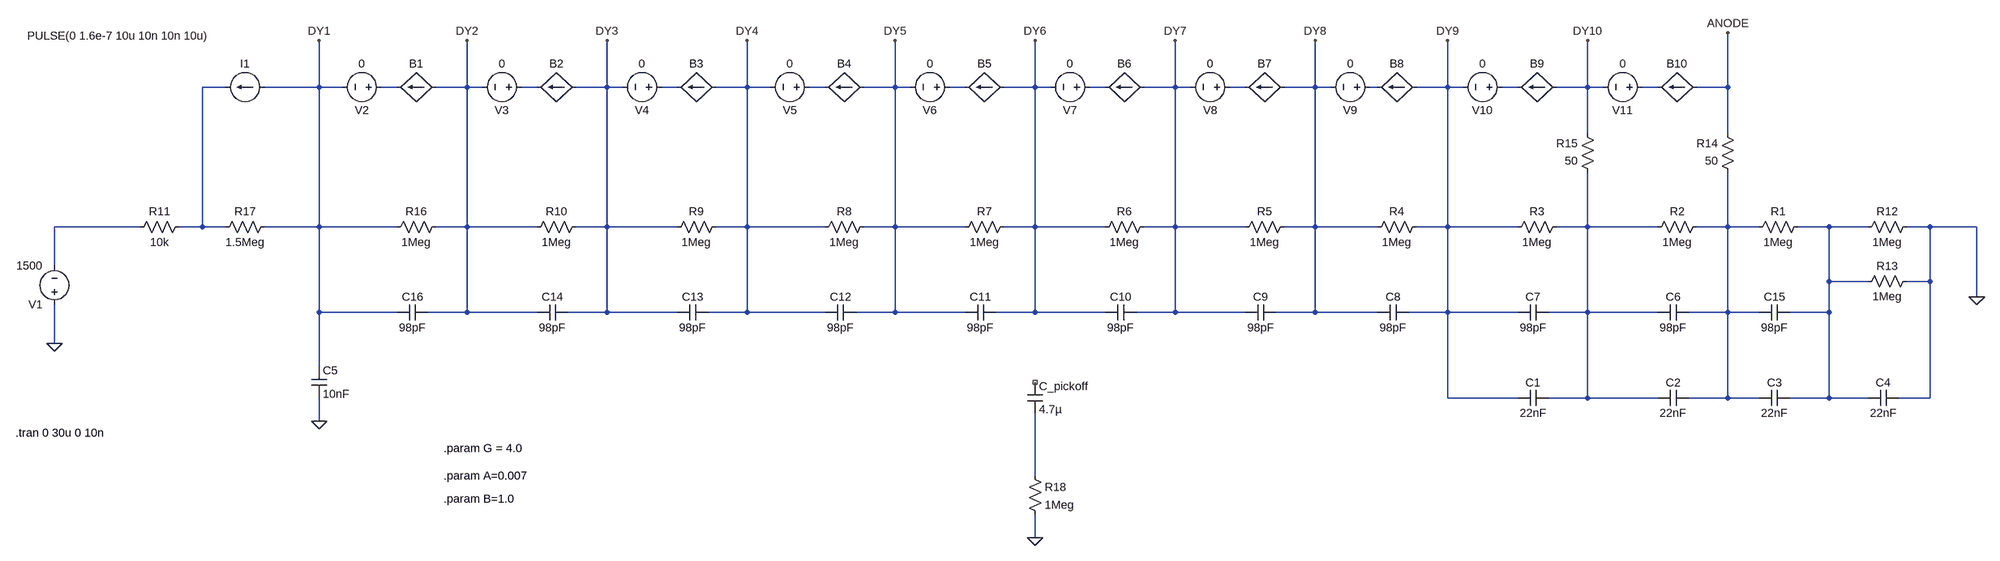
[diagram p0: schematic R12699 model.asc]
R12699 model.asc, the LTspice schematic file:
Version 4.1
SHEET 1 1204 680
WIRE -2416 -544 -2464 -544
WIRE -2224 -544 -2224 -640
WIRE -2224 -544 -2336 -544
WIRE -2176 -544 -2224 -544
WIRE -2064 -544 -2096 -544
WIRE -1920 -544 -1920 -640
WIRE -1920 -544 -1984 -544
WIRE -1888 -544 -1920 -544
WIRE -1776 -544 -1808 -544
WIRE -1632 -544 -1632 -640
WIRE -1632 -544 -1696 -544
WIRE -1600 -544 -1632 -544
WIRE -1488 -544 -1520 -544
WIRE -1344 -544 -1344 -640
WIRE -1344 -544 -1408 -544
WIRE -1296 -544 -1344 -544
WIRE -1184 -544 -1216 -544
WIRE -1040 -544 -1040 -640
WIRE -1040 -544 -1104 -544
WIRE -1008 -544 -1040 -544
WIRE -896 -544 -928 -544
WIRE -752 -544 -752 -640
WIRE -752 -544 -816 -544
WIRE -720 -544 -752 -544
WIRE -608 -544 -640 -544
WIRE -464 -544 -464 -640
WIRE -464 -544 -528 -544
WIRE -432 -544 -464 -544
WIRE -320 -544 -352 -544
WIRE -176 -544 -176 -640
WIRE -176 -544 -240 -544
WIRE -144 -544 -176 -544
WIRE -48 -544 -64 -544
WIRE 96 -544 96 -640
WIRE 96 -544 32 -544
WIRE 128 -544 96 -544
WIRE 240 -544 208 -544
WIRE 384 -544 384 -640
WIRE 384 -544 320 -544
WIRE 416 -544 384 -544
WIRE 528 -544 496 -544
WIRE 672 -544 672 -656
WIRE 672 -544 608 -544
WIRE 384 -448 384 -544
WIRE 672 -448 672 -544
WIRE -2592 -256 -2768 -256
WIRE -2464 -256 -2464 -544
WIRE -2464 -256 -2512 -256
WIRE -2416 -256 -2464 -256
WIRE -2224 -256 -2224 -544
WIRE -2224 -256 -2336 -256
WIRE -2064 -256 -2224 -256
WIRE -1920 -256 -1920 -544
WIRE -1920 -256 -1984 -256
WIRE -1776 -256 -1920 -256
WIRE -1632 -256 -1632 -544
WIRE -1632 -256 -1696 -256
WIRE -1488 -256 -1632 -256
WIRE -1344 -256 -1344 -544
WIRE -1344 -256 -1408 -256
WIRE -1184 -256 -1344 -256
WIRE -1040 -256 -1040 -544
WIRE -1040 -256 -1104 -256
WIRE -896 -256 -1040 -256
WIRE -752 -256 -752 -544
WIRE -752 -256 -816 -256
WIRE -608 -256 -752 -256
WIRE -464 -256 -464 -544
WIRE -464 -256 -528 -256
WIRE -320 -256 -464 -256
WIRE -176 -256 -176 -544
WIRE -176 -256 -240 -256
WIRE -48 -256 -176 -256
WIRE 96 -256 96 -544
WIRE 96 -256 32 -256
WIRE 240 -256 96 -256
WIRE 384 -256 384 -368
WIRE 384 -256 320 -256
WIRE 528 -256 384 -256
WIRE 672 -256 672 -368
WIRE 672 -256 608 -256
WIRE 736 -256 672 -256
WIRE 880 -256 816 -256
WIRE 960 -256 880 -256
WIRE 1088 -256 1040 -256
WIRE 1184 -256 1088 -256
WIRE -2768 -176 -2768 -256
WIRE 880 -144 880 -256
WIRE 960 -144 880 -144
WIRE 1088 -144 1088 -256
WIRE 1088 -144 1040 -144
WIRE 1184 -112 1184 -256
WIRE -2224 -80 -2224 -256
WIRE -2064 -80 -2224 -80
WIRE -1920 -80 -1920 -256
WIRE -1920 -80 -2000 -80
WIRE -1776 -80 -1920 -80
WIRE -1632 -80 -1632 -256
WIRE -1632 -80 -1712 -80
WIRE -1488 -80 -1632 -80
WIRE -1344 -80 -1344 -256
WIRE -1344 -80 -1424 -80
WIRE -1184 -80 -1344 -80
WIRE -1040 -80 -1040 -256
WIRE -1040 -80 -1120 -80
WIRE -896 -80 -1040 -80
WIRE -752 -80 -752 -256
WIRE -752 -80 -832 -80
WIRE -608 -80 -752 -80
WIRE -464 -80 -464 -256
WIRE -464 -80 -544 -80
WIRE -320 -80 -464 -80
WIRE -176 -80 -176 -256
WIRE -176 -80 -256 -80
WIRE -48 -80 -176 -80
WIRE 96 -80 96 -256
WIRE 96 -80 16 -80
WIRE 240 -80 96 -80
WIRE 384 -80 384 -256
WIRE 384 -80 304 -80
WIRE 528 -80 384 -80
WIRE 672 -80 672 -256
WIRE 672 -80 592 -80
WIRE 736 -80 672 -80
WIRE 880 -80 880 -144
WIRE 880 -80 800 -80
WIRE -2768 -16 -2768 -96
WIRE -2224 32 -2224 -80
WIRE 96 96 96 -80
WIRE 240 96 96 96
WIRE 384 96 384 -80
WIRE 384 96 304 96
WIRE 528 96 384 96
WIRE 672 96 672 -80
WIRE 672 96 592 96
WIRE 736 96 672 96
WIRE 880 96 880 -80
WIRE 880 96 800 96
WIRE 960 96 880 96
WIRE 1088 96 1088 -144
WIRE 1088 96 1024 96
WIRE -2224 144 -2224 96
WIRE -752 256 -752 128
WIRE -752 384 -752 336
FLAG -2224 144 0
FLAG 1184 -112 0
FLAG -2768 -16 0
FLAG -2224 -640 DY1
FLAG -1920 -640 DY2
FLAG -1632 -640 DY3
FLAG -1344 -640 DY4
FLAG -1040 -640 DY5
FLAG -752 -640 DY6
FLAG -464 -640 DY7
FLAG -176 -640 DY8
FLAG 96 -640 DY9
FLAG 384 -640 DY10
FLAG 672 -656 ANODE
FLAG -752 384 0
SYMBOL cap 304 80 R90
WINDOW 0 0 32 VBottom 2
WINDOW 3 32 32 VTop 2
SYMATTR InstName C1
SYMATTR Value 22nF
SYMBOL cap 592 80 R90
WINDOW 0 0 32 VBottom 2
WINDOW 3 32 32 VTop 2
SYMATTR InstName C2
SYMATTR Value 22nF
SYMBOL cap 800 80 R90
WINDOW 0 0 32 VBottom 2
WINDOW 3 32 32 VTop 2
SYMATTR InstName C3
SYMATTR Value 22nF
SYMBOL cap 1024 80 R90
WINDOW 0 0 32 VBottom 2
WINDOW 3 32 32 VTop 2
SYMATTR InstName C4
SYMATTR Value 22nF
SYMBOL cap -2240 32 R0
SYMATTR InstName C5
SYMATTR Value 10nF
SYMBOL cap 800 -96 R90
WINDOW 0 0 32 VBottom 2
WINDOW 3 32 32 VTop 2
SYMATTR InstName C15
SYMATTR Value 98pF
SYMBOL res 832 -272 R90
WINDOW 0 0 56 VBottom 2
WINDOW 3 32 56 VTop 2
SYMATTR InstName R1
SYMATTR Value 1Meg
SYMBOL cap 592 -96 R90
WINDOW 0 0 32 VBottom 2
WINDOW 3 32 32 VTop 2
SYMATTR InstName C6
SYMATTR Value 98pF
SYMBOL res 624 -272 R90
WINDOW 0 0 56 VBottom 2
WINDOW 3 32 56 VTop 2
SYMATTR InstName R2
SYMATTR Value 1Meg
SYMBOL cap 304 -96 R90
WINDOW 0 0 32 VBottom 2
WINDOW 3 32 32 VTop 2
SYMATTR InstName C7
SYMATTR Value 98pF
SYMBOL res 336 -272 R90
WINDOW 0 0 56 VBottom 2
WINDOW 3 32 56 VTop 2
SYMATTR InstName R3
SYMATTR Value 1Meg
SYMBOL cap 16 -96 R90
WINDOW 0 0 32 VBottom 2
WINDOW 3 32 32 VTop 2
SYMATTR InstName C8
SYMATTR Value 98pF
SYMBOL res 48 -272 R90
WINDOW 0 0 56 VBottom 2
WINDOW 3 32 56 VTop 2
SYMATTR InstName R4
SYMATTR Value 1Meg
SYMBOL cap -256 -96 R90
WINDOW 0 0 32 VBottom 2
WINDOW 3 32 32 VTop 2
SYMATTR InstName C9
SYMATTR Value 98pF
SYMBOL res -224 -272 R90
WINDOW 0 0 56 VBottom 2
WINDOW 3 32 56 VTop 2
SYMATTR InstName R5
SYMATTR Value 1Meg
SYMBOL cap -544 -96 R90
WINDOW 0 0 32 VBottom 2
WINDOW 3 32 32 VTop 2
SYMATTR InstName C10
SYMATTR Value 98pF
SYMBOL res -512 -272 R90
WINDOW 0 0 56 VBottom 2
WINDOW 3 32 56 VTop 2
SYMATTR InstName R6
SYMATTR Value 1Meg
SYMBOL cap -832 -96 R90
WINDOW 0 0 32 VBottom 2
WINDOW 3 32 32 VTop 2
SYMATTR InstName C11
SYMATTR Value 98pF
SYMBOL res -800 -272 R90
WINDOW 0 0 56 VBottom 2
WINDOW 3 32 56 VTop 2
SYMATTR InstName R7
SYMATTR Value 1Meg
SYMBOL cap -1120 -96 R90
WINDOW 0 0 32 VBottom 2
WINDOW 3 32 32 VTop 2
SYMATTR InstName C12
SYMATTR Value 98pF
SYMBOL res -1088 -272 R90
WINDOW 0 0 56 VBottom 2
WINDOW 3 32 56 VTop 2
SYMATTR InstName R8
SYMATTR Value 1Meg
SYMBOL cap -1424 -96 R90
WINDOW 0 0 32 VBottom 2
WINDOW 3 32 32 VTop 2
SYMATTR InstName C13
SYMATTR Value 98pF
SYMBOL res -1392 -272 R90
WINDOW 0 0 56 VBottom 2
WINDOW 3 32 56 VTop 2
SYMATTR InstName R9
SYMATTR Value 1Meg
SYMBOL cap -1712 -96 R90
WINDOW 0 0 32 VBottom 2
WINDOW 3 32 32 VTop 2
SYMATTR InstName C14
SYMATTR Value 98pF
SYMBOL res -1680 -272 R90
WINDOW 0 0 56 VBottom 2
WINDOW 3 32 56 VTop 2
SYMATTR InstName R10
SYMATTR Value 1Meg
SYMBOL res -2496 -272 R90
WINDOW 0 0 56 VBottom 2
WINDOW 3 32 56 VTop 2
SYMATTR InstName R11
SYMATTR Value 10k
SYMBOL res 1056 -272 R90
WINDOW 0 0 56 VBottom 2
WINDOW 3 32 56 VTop 2
SYMATTR InstName R12
SYMATTR Value 1Meg
SYMBOL res 1056 -160 R90
WINDOW 0 0 56 VBottom 2
WINDOW 3 32 56 VTop 2
SYMATTR InstName R13
SYMATTR Value 1Meg
SYMBOL res 688 -352 R180
WINDOW 0 36 76 Left 2
WINDOW 3 36 40 Left 2
SYMATTR InstName R14
SYMATTR Value 50
SYMBOL res 400 -352 R180
WINDOW 0 36 76 Left 2
WINDOW 3 36 40 Left 2
SYMATTR InstName R15
SYMATTR Value 50
SYMBOL cap -2000 -96 R90
WINDOW 0 0 32 VBottom 2
WINDOW 3 32 32 VTop 2
SYMATTR InstName C16
SYMATTR Value 98pF
SYMBOL res -1968 -272 R90
WINDOW 0 0 56 VBottom 2
WINDOW 3 32 56 VTop 2
SYMATTR InstName R16
SYMATTR Value 1Meg
SYMBOL bi -1984 -544 R90
WINDOW 0 -32 40 VBottom 2
WINDOW 3 32 40 Invisible 2
SYMATTR InstName B1
SYMATTR Value I=I(I1)*max(0, G - A * V(DY1,DY2)**B)
SYMBOL bi -1696 -544 R90
WINDOW 0 -32 40 VBottom 2
WINDOW 3 32 40 Invisible 2
SYMATTR InstName B2
SYMATTR Value I=I(V2)*max(0, G - A * V(DY2,DY3)**B)
SYMBOL bi -1408 -544 R90
WINDOW 0 -32 40 VBottom 2
WINDOW 3 32 40 Invisible 2
SYMATTR InstName B3
SYMATTR Value I=I(V3)*max(0, G - A * V(DY3,DY4)**B)
SYMBOL current -2336 -544 R90
WINDOW 0 -32 40 VBottom 2
WINDOW 3 -121 301 VTop 2
WINDOW 123 0 0 Left 0
WINDOW 39 0 0 Left 0
SYMATTR InstName I1
SYMATTR Value PULSE(0 1.6e-7 10u 10n 10n 10u)
SYMBOL bi -1104 -544 R90
WINDOW 0 -32 40 VBottom 2
WINDOW 3 32 40 Invisible 2
SYMATTR InstName B4
SYMATTR Value I=I(V4)*max(0, G - A * V(DY4,DY5)**B)
SYMBOL bi -816 -544 R90
WINDOW 0 -32 40 VBottom 2
WINDOW 3 32 40 Invisible 2
SYMATTR InstName B5
SYMATTR Value I=I(V5)*max(0, G - A * V(DY5,DY6)**B)
SYMBOL bi -528 -544 R90
WINDOW 0 -32 40 VBottom 2
WINDOW 3 32 40 Invisible 2
SYMATTR InstName B6
SYMATTR Value I=I(V6)*max(0, G - A * V(DY6,DY7)**B)
SYMBOL bi -240 -544 R90
WINDOW 0 -32 40 VBottom 2
WINDOW 3 32 40 Invisible 2
SYMATTR InstName B7
SYMATTR Value I=I(V7)*max(0, G - A * V(DY7,DY8)**B)
SYMBOL bi 32 -544 R90
WINDOW 0 -32 40 VBottom 2
WINDOW 3 32 40 Invisible 2
SYMATTR InstName B8
SYMATTR Value I=I(V8)*max(0, G - A * V(DY8,DY9)**B)
SYMBOL bi 320 -544 R90
WINDOW 0 -32 40 VBottom 2
WINDOW 3 32 40 Invisible 2
SYMATTR InstName B9
SYMATTR Value I=I(V9)*max(0, G - A * V(DY9,DY10)**B)
SYMBOL bi 608 -544 R90
WINDOW 0 -32 40 VBottom 2
WINDOW 3 32 40 Invisible 2
SYMATTR InstName B10
SYMATTR Value I=I(V10)*max(0, G - A * V(DY10,ANODE)**B)
SYMBOL res -2320 -272 R90
WINDOW 0 0 56 VBottom 2
WINDOW 3 32 56 VTop 2
SYMATTR InstName R17
SYMATTR Value 1.5Meg
SYMBOL voltage -2768 -80 R180
WINDOW 123 0 0 Left 0
WINDOW 39 0 0 Left 0
SYMATTR InstName V1
SYMATTR Value 1500
SYMBOL voltage -2080 -544 R90
WINDOW 0 32 56 VTop 2
WINDOW 3 -32 56 VBottom 2
WINDOW 123 0 0 Left 0
WINDOW 39 4 56 VTop 2
SYMATTR InstName V2
SYMATTR Value 0
SYMBOL voltage -1792 -544 R90
WINDOW 0 32 56 VTop 2
WINDOW 3 -32 56 VBottom 2
WINDOW 123 0 0 Left 0
WINDOW 39 4 56 VTop 2
SYMATTR InstName V3
SYMATTR Value 0
SYMBOL voltage -1504 -544 R90
WINDOW 0 32 56 VTop 2
WINDOW 3 -32 56 VBottom 2
WINDOW 123 0 0 Left 0
WINDOW 39 4 56 VTop 2
SYMATTR InstName V4
SYMATTR Value 0
SYMBOL voltage -1200 -544 R90
WINDOW 0 32 56 VTop 2
WINDOW 3 -32 56 VBottom 2
WINDOW 123 0 0 Left 0
WINDOW 39 4 56 VTop 2
SYMATTR InstName V5
SYMATTR Value 0
SYMBOL voltage -912 -544 R90
WINDOW 0 32 56 VTop 2
WINDOW 3 -32 56 VBottom 2
WINDOW 123 0 0 Left 0
WINDOW 39 4 56 VTop 2
SYMATTR InstName V6
SYMATTR Value 0
SYMBOL voltage -624 -544 R90
WINDOW 0 32 56 VTop 2
WINDOW 3 -32 56 VBottom 2
WINDOW 123 0 0 Left 0
WINDOW 39 4 56 VTop 2
SYMATTR InstName V7
SYMATTR Value 0
SYMBOL voltage -336 -544 R90
WINDOW 0 32 56 VTop 2
WINDOW 3 -32 56 VBottom 2
WINDOW 123 0 0 Left 0
WINDOW 39 4 56 VTop 2
SYMATTR InstName V8
SYMATTR Value 0
SYMBOL voltage -48 -544 R90
WINDOW 0 32 56 VTop 2
WINDOW 3 -32 56 VBottom 2
WINDOW 123 0 0 Left 0
WINDOW 39 4 56 VTop 2
SYMATTR InstName V9
SYMATTR Value 0
SYMBOL voltage 224 -544 R90
WINDOW 0 32 56 VTop 2
WINDOW 3 -32 56 VBottom 2
WINDOW 123 0 0 Left 0
WINDOW 39 4 56 VTop 2
SYMATTR InstName V10
SYMATTR Value 0
SYMBOL voltage 512 -544 R90
WINDOW 0 32 56 VTop 2
WINDOW 3 -32 56 VBottom 2
WINDOW 123 0 0 Left 0
WINDOW 39 4 56 VTop 2
SYMATTR InstName V11
SYMATTR Value 0
SYMBOL cap -768 64 R0
SYMATTR InstName C_pickoff
SYMATTR Value 4.7µ
SYMBOL res -768 240 R0
SYMATTR InstName R18
SYMATTR Value 1Meg
TEXT -2848 168 Left 2 !.tran 0 30u 0 10n
TEXT -1968 200 Left 2 !.param G = 4.0
TEXT -1968 256 Left 2 !.param A=0.007
TEXT -1968 304 Left 2 !.param B=1.0

The netlist it stands for:
* R12699 model.asc
C1 N013 DY9 22nF
C2 N014 N013 22nF
C3 N015 N014 22nF
C4 0 N015 22nF
C5 DY1 0 10nF
C15 N015 N014 98pF
R1 N015 N014 1Meg
C6 N014 N013 98pF
R2 N014 N013 1Meg
C7 N013 DY9 98pF
R3 N013 DY9 1Meg
C8 DY9 DY8 98pF
R4 DY9 DY8 1Meg
C9 DY8 DY7 98pF
R5 DY8 DY7 1Meg
C10 DY7 DY6 98pF
R6 DY7 DY6 1Meg
C11 DY6 DY5 98pF
R7 DY6 DY5 1Meg
C12 DY5 DY4 98pF
R8 DY5 DY4 1Meg
C13 DY4 DY3 98pF
R9 DY4 DY3 1Meg
C14 DY3 DY2 98pF
R10 DY3 DY2 1Meg
R11 N001 N012 10k
R12 0 N015 1Meg
R13 0 N015 1Meg
R14 N014 ANODE 50
R15 N013 DY10 50
C16 DY2 DY1 98pF
R16 DY2 DY1 1Meg
B1 DY2 N002 I=I(I1)*max(0, G - A * V(DY1,DY2)**B)
B2 DY3 N003 I=I(V2)*max(0, G - A * V(DY2,DY3)**B)
B3 DY4 N004 I=I(V3)*max(0, G - A * V(DY3,DY4)**B)
I1 DY1 N001 PULSE(0 1.6e-7 10u 10n 10n 10u)
B4 DY5 N005 I=I(V4)*max(0, G - A * V(DY4,DY5)**B)
B5 DY6 N006 I=I(V5)*max(0, G - A * V(DY5,DY6)**B)
B6 DY7 N007 I=I(V6)*max(0, G - A * V(DY6,DY7)**B)
B7 DY8 N008 I=I(V7)*max(0, G - A * V(DY7,DY8)**B)
B8 DY9 N009 I=I(V8)*max(0, G - A * V(DY8,DY9)**B)
B9 DY10 N010 I=I(V9)*max(0, G - A * V(DY9,DY10)**B)
B10 ANODE N011 I=I(V10)*max(0, G - A * V(DY10,ANODE)**B)
R17 DY1 N001 1.5Meg
V1 0 N012 1500
V2 N002 DY1 0
V3 N003 DY2 0
V4 N004 DY3 0
V5 N005 DY4 0
V6 N006 DY5 0
V7 N007 DY6 0
V8 N008 DY7 0
V9 N009 DY8 0
V10 N010 DY9 0
V11 N011 DY10 0
C_pickoff NC_01 N016 4.7µ
R18 N016 0 1Meg
.tran 0 30u 0 10n
.param G = 4.0
.param A=0.007
.param B=1.0
.backanno
.end